# EAGLE design ATtiny10_Writer (EAGLE 9.1.3)
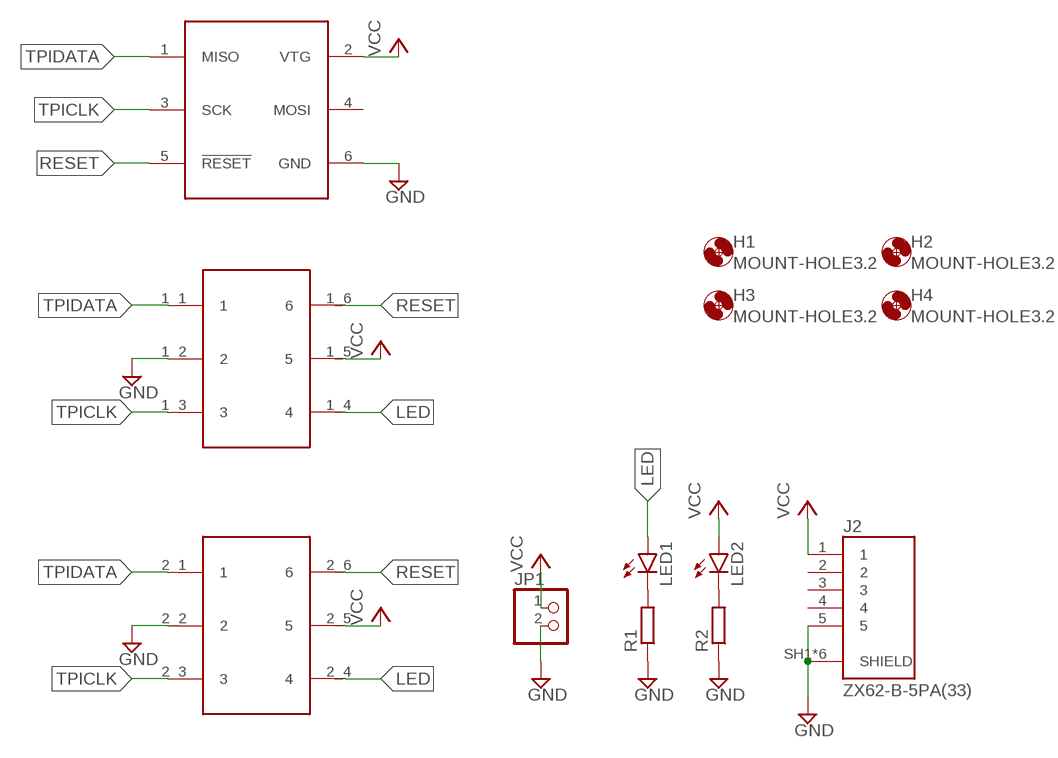
[diagram p0: schematic, sheet 1]

## Parts
CON1  AVR_ISP  [AVR_ISP]
H1  MOUNT-HOLE3.2  [3,2]
H2  MOUNT-HOLE3.2  [3,2]
H3  MOUNT-HOLE3.2  [3,2]
H4  MOUNT-HOLE3.2  [3,2]
J1  SOT23-6_2_SOCKET  [IC_SOCKET_051-2317-060]
J2  ZX62-B-5PA(33)  [HRS_ZX62-B-5PA(33)]
JP1  PINHD-1X2  [1X02]
LED1  LEDCHIP-LED0603  [CHIP-LED0603]
LED2  LEDCHIP-LED0603  [CHIP-LED0603]
R1  R-EU_R0603  [R0603]
R2  R-EU_R0603  [R0603]

## Nets
GND: CON1.6(GND) J1.1_2 J1.2_2 J2.5 J2.SH1(SHIELD) J2.SH2(SHIELD) J2.SH3(SHIELD) J2.SH4(SHIELD) J2.SH5(SHIELD) J2.SH6(SHIELD) JP1.2 R1.1 R2.1
LED: J1.1_4 J1.2_4 LED1.A
N$1: LED1.C R1.2
N$2: LED2.C R2.2
RESET: CON1.5(!RESET) J1.1_6 J1.2_6
TPICLK: CON1.3(SCK) J1.1_3 J1.2_3
TPIDATA: CON1.1(MISO) J1.1_1 J1.2_1
VCC: CON1.2(VTG) J1.1_5 J1.2_5 J2.1 JP1.1 LED2.A
Unconnected: CON1.4(MOSI) J2.2 J2.3 J2.4

## Library data of the parts
CON1 = CONNECTOR:AVR_ISP: Box Header for AVR ISP 6pin connector
H1-H4 = holes:MOUNT-HOLE: MOUNTING HOLE with drill center marker
J1 = IC_SOCKET:SOT23-6_2_SOCKET
J2 = ZX62-B-5PA_33_:ZX62-B-5PA(33): ZX Series 5 Position Right Angle PCB Wire Micro B USB Plug; AVAILABILITY: Unavailable; DESCRIPTION: ZX Series 5 Position Right Angle PCB Wire Micro B USB Plug; MF: Hirose; MP: ZX62-B-5PA_33_; PACKAGE: None; PRICE: None
JP1 = pinhead:PINHD-1X2: PIN HEADER
LED1 LED2 = led:LED: LED OSRAM: - CHIPLED LG R971, LG N971, LY N971, LG Q971, LY Q971, LO R971, LY R971 LH N974, LH R974 LS Q976, LO Q976, LY Q976 LO Q996 - Hyper CHIPLED LW Q18S LB Q993, LB Q99A, LB R99A - SideLED LS A670, LO A670, LY A670, LG A670, LP A670 LB A673, LV A673, LT A673, LW A673 LH A674 LY A675 LS A676, LA A676, LO A676, LY A676, LW A676 LS A679, LY A679, LG A679 - Hyper Micro SIDELED® LS Y876, LA Y876, LO Y876, LY Y876 LT Y87S - SmartLED LW L88C, LW L88S LB L89C, LB L89S, LG L890 LS L89K, LO L89K, LY L89K LS L896, LA L896, LO L896, LY L896 - TOPLED LS T670, LO T670, LY T670, LG T670, LP T670 LSG T670, LSP T670, LSY T670, LOP T670, LYG T670 LG T671, LOG T671, LSG T671 LB T673, LV T673, LT T673, LW T673 LH T674 LS T676, LA T676, LO T676, LY T676, LB T676, LH T676, LSB T676, LW T676 LB T67C, LV T67C, LT T67C, LS T67K, LO T67K, LY T67K, LW E67C LS E67B, LA E67B, LO E67B, LY E67B, LB E67C, LV E67C, LT E67C LW T67C LS T679, LY T679, LG T679 LS T770, LO T770, LY T770, LG T770, LP T770 LB T773, LV T773, LT T773, LW T773 LH T774 LS E675, LA E675, LY E675, LS T675 LS T776, LA T776, LO T776, LY T776, LB T776 LHGB T686 LT T68C, LB T68C - Hyper Mini TOPLED® LB M676 - Mini TOPLED Santana® LG M470 LS M47K, LO M47K, LY M47K Source: http://www.osram.convergy.de LUXEON: - LUMILED® LXK2-PW12-R00, LXK2-PW12-S00, LXK2-PW14-U00, LXK2-PW14-V00 LXK2-PM12-R00, LXK2-PM12-S00, LXK2-PM14-U00 LXK2-PE12-Q00, LXK2-PE12-R00, LXK2-PE12-S00, LXK2-PE14-T00, LXK2-PE14-U00 LXK2-PB12-K00, LXK2-PB12-L00, LXK2-PB12-M00, LXK2-PB14-N00, LXK2-PB14-P00, LXK2-PB14-Q00 LXK2-PR12-L00, LXK2-PR12-M00, LXK2-PR14-Q00, LXK2-PR14-R00 LXK2-PD12-Q00, LXK2-PD12-R00, LXK2-PD12-S00 LXK2-PH12-R00, LXK2-PH12-S00 LXK2-PL12-P00, LXK2-PL12-Q00, LXK2-PL12-R00 Source: www.luxeon.com KINGBRIGHT: KA-3528ASYC Source: www.kingbright.com
R1 R2 = rcl:R-EU_: RESISTOR, European symbol; SPICEPREFIX: R

## Board
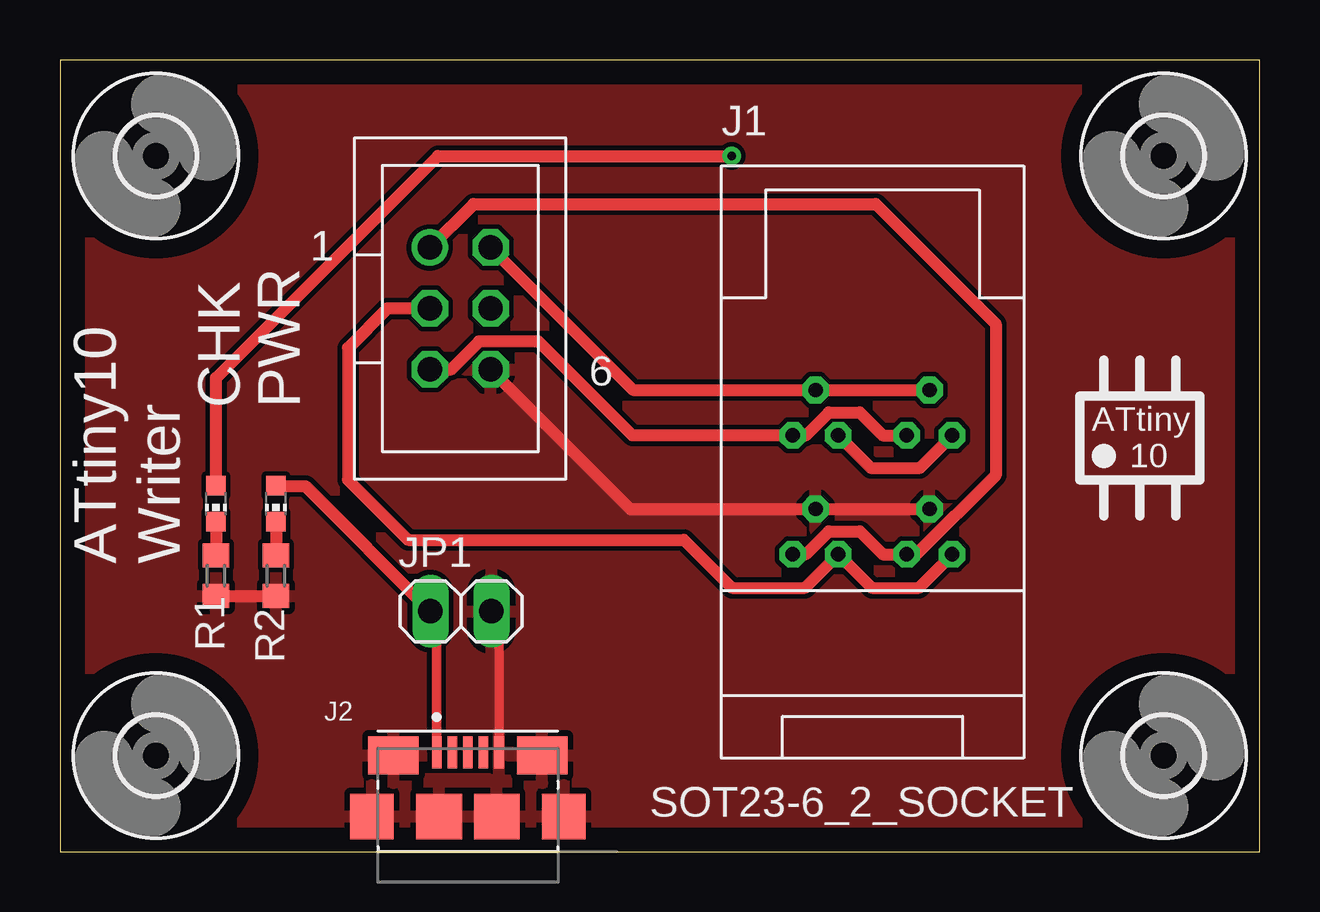
[diagram p1: board, top side]
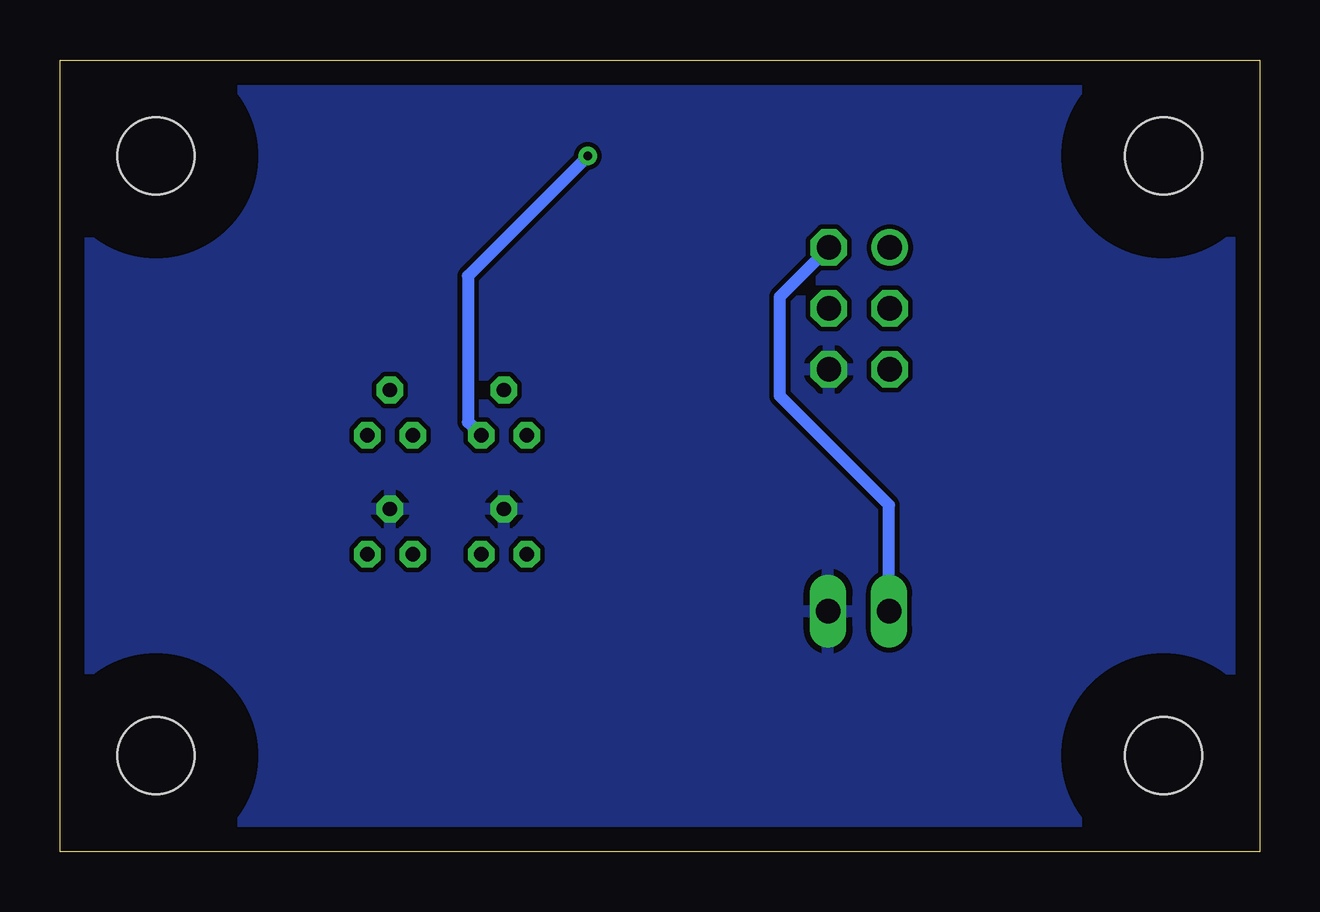
[diagram p2: board, bottom side, seen from below]

Size 50 x 33 mm. Coordinates in mm from the lower left corner, seen from the top.
Outline: 0,0 50,0 50,33 0,33 0,0
Copper layers (1*16): Top 0.035mm / dielectric 1.5mm / Bottom 0.035mm
Design rules "default": minimum track width 6mil, minimum drill 0.35mm, track to track 6mil, track to pad 6mil, pad to pad 6mil, via to via 6mil, smd to smd 6mil, copper to edge 40mil, drill to drill 6mil, minimum pad ring 10mil, minimum via ring 8mil, stop-mask expansion 4mil, vias tented up to drill 0mil, thermal gap 10mil

### Footprints (pad centres in the part's own frame; a part is rotated, then mirrored left to right if it is on the bottom)
AVR_ISP = drill 1.016: 1 -1.27,2.54 | drill 1.016 octagon: 2 1.27,2.54; 3 -1.27,0; 4 1.27,0; 5 -1.27,-2.54; 6 1.27,-2.54
3,2 = hole 3.2: 0,0
IC_SOCKET_051-2317-060 = drill 0.6 pad 1.1 octagon: 1_1 -3.325,-3.85; 1_2 -2.375,-1.96; 1_3 -1.425,-3.85; 1_4 -1.425,1.11; 1_5 -2.375,3; 1_6 -3.325,1.11; 2_1 1.425,-3.85; 2_2 2.375,-1.96; 2_3 3.325,-3.85; 2_4 3.325,1.11; 2_5 2.375,3; 2_6 1.425,1.11
HRS_ZX62-B-5PA(33) = smd 0.4 x 1.35: 1 -1.3,2.675; 2 -0.65,2.675; 3 0,2.675; 4 0.65,2.675; 5 1.3,2.675 | smd 2.1 x 1.6: SH1 -3.1,2.55; SH6 3.1,2.55 | smd 1.8 x 1.9: SH2 -4,0; SH5 4,0 | smd 1.9 x 1.9: SH3 -1.2,0; SH4 1.2,0
1X02 = drill 1.016 long: 1 -1.27,0; 2 1.27,0
CHIP-LED0603 = smd 0.8 x 0.8: A 0,-0.75; C 0,0.75
R0603 = smd 1 x 1.1: 1 -0.85,0; 2 0.85,0

### Placement (x,y rotation side)
CON1  16.68,22.64 0 top
H1  4,29 0 top
H2  46,29 0 top
H3  46,4 0 top
H4  4,4 0 top
J1  33.87,16.24 0 top
J2  17,1.46 0 top
JP1  16.71,10.02 0 top
LED1  6.5,14.5 180 top
LED2  9,14.5 180 top
R1  6.5,11.5 90 top
R2  9,11.5 90 top

### Tracks (layer width: path | path; a pad name or v marks a point on that pad's centre or on a via)
GND
  Top 0.4: J2.5 18.3,9.7 JP1.2
  Top 0.5: J1.2_2 J1.1_2 23.77,14.28 CON1.6 | R1.1 R2.1
  pour Bottom (isolate 0.2): 0,33 50,33 50,0 0,0
  pour Top (isolate 0.2): 0,33 50,33 50,0 0,0
LED  (via drill 0.35)
  Top 0.5: J1.1_4 33.8,16 35.84,16 J1.2_4 | v28,29 15.75,29 6.5,19.75 LED1.A
  Bottom 0.5: v28,29 33,24 33,17.91 J1.1_4
N$1
  Top 0.5: LED1.C R1.2
N$2
  Top 0.5: LED2.C R2.2
RESET
  Top 0.5: J1.2_6 34.3,17.35 33.34,18.31 32.05,18.31 31.09,17.35 J1.1_6 23.86,17.35 19.94,21.26 17.47,21.26 16.3,20.1 CON1.5
TPICLK
  Top 0.5: J1.2_3 35.8,11 33.84,11 J1.1_3 31.05,11 28,11 26,13 14.5,13 12,15.5 12,21 13.64,22.64 CON1.3
TPIDATA
  Top 0.5: J1.1_1 31.09,12.39 32.05,13.35 33.34,13.35 34.3,12.39 J1.2_1 35.71,12.39 39,15.68 39,22 34,27 17.23,27 CON1.1
VCC
  Top 0.4: J2.1 15.7,9.76 | 15.7,9.76 JP1.1 | 10.23,15.23 15.7,9.76
  Top 0.5: J1.2_5 J1.1_5 23.89,19.24 CON1.2 | 14.98,10.02 JP1.1 10.23,15.23 9.02,15.23 LED2.A
  Bottom 0.5: JP1.1 15.44,14.44 20,19 20,23.13 CON1.2

### Text on the board
tPlace: CHK | PWR | ATtiny / 10 | ATtiny10 / Writer